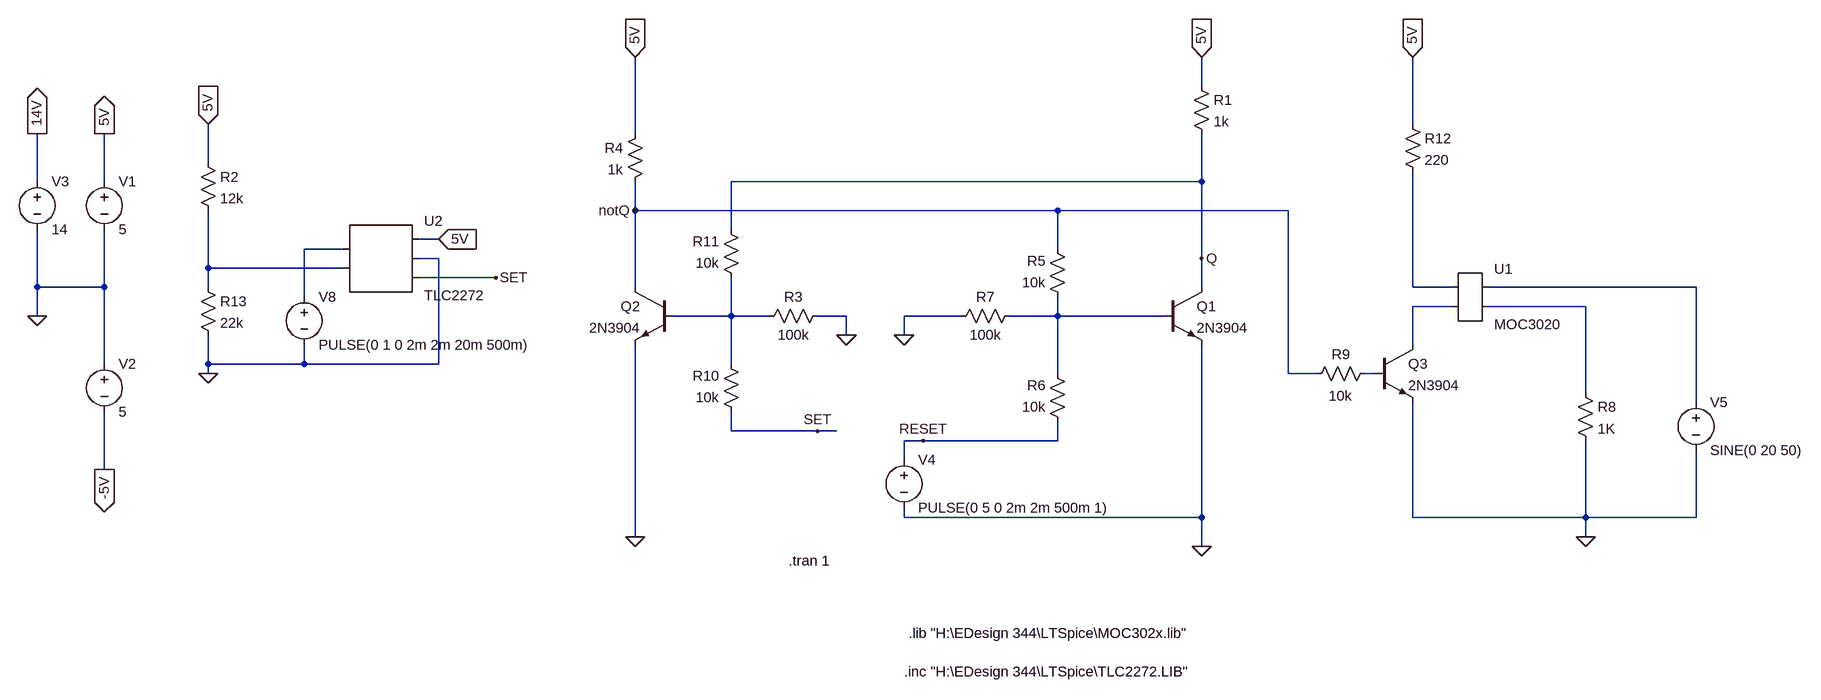
[diagram p0: schematic switch.asc]
switch.asc, the LTspice schematic file:
Version 4
SHEET 1 1960 1220
WIRE -656 -432 -656 -480
WIRE -304 -368 -304 -480
WIRE -1600 -352 -1600 -480
WIRE -2720 -304 -2720 -368
WIRE -3120 -272 -3120 -352
WIRE -3008 -272 -3008 -352
WIRE -656 -272 -656 -352
WIRE -656 -272 -1440 -272
WIRE -1600 -224 -1600 -272
WIRE -896 -224 -1600 -224
WIRE -512 -224 -896 -224
WIRE -1440 -192 -1440 -272
WIRE -2336 -176 -2368 -176
WIRE -2496 -160 -2560 -160
WIRE -896 -160 -896 -224
WIRE -2336 -144 -2368 -144
WIRE -656 -144 -656 -272
WIRE -2720 -128 -2720 -224
WIRE -2496 -128 -2720 -128
WIRE -2240 -112 -2368 -112
WIRE -3120 -96 -3120 -192
WIRE -3008 -96 -3008 -192
WIRE -3008 -96 -3120 -96
WIRE -2720 -96 -2720 -128
WIRE -1600 -96 -1600 -224
WIRE -656 -96 -656 -144
WIRE -304 -96 -304 -288
WIRE -240 -96 -304 -96
WIRE 208 -96 -176 -96
WIRE -2560 -80 -2560 -160
WIRE -240 -64 -304 -64
WIRE -16 -64 -176 -64
WIRE -3120 -48 -3120 -96
WIRE -1440 -48 -1440 -112
WIRE -1440 -48 -1536 -48
WIRE -1376 -48 -1440 -48
WIRE -1248 -48 -1296 -48
WIRE -1056 -48 -1152 -48
WIRE -896 -48 -896 -80
WIRE -896 -48 -976 -48
WIRE -720 -48 -896 -48
WIRE -1248 -16 -1248 -48
WIRE -1152 -16 -1152 -48
WIRE -304 0 -304 -64
WIRE -3008 32 -3008 -96
WIRE -2720 32 -2720 -16
WIRE -2560 32 -2560 0
WIRE -2560 32 -2720 32
WIRE -2336 32 -2336 -144
WIRE -2336 32 -2560 32
WIRE -1440 32 -1440 -48
WIRE -2720 48 -2720 32
WIRE -896 48 -896 -48
WIRE -512 48 -512 -224
WIRE -464 48 -512 48
WIRE -368 48 -384 48
WIRE -16 80 -16 -64
WIRE 208 96 208 -96
WIRE -1440 144 -1440 112
WIRE -1296 144 -1440 144
WIRE -1264 144 -1296 144
WIRE -1120 160 -1152 160
WIRE -896 160 -896 128
WIRE -896 160 -1120 160
WIRE -1152 192 -1152 160
WIRE -3008 208 -3008 112
WIRE -1152 288 -1152 272
WIRE -656 288 -656 0
WIRE -656 288 -1152 288
WIRE -304 288 -304 96
WIRE -16 288 -16 160
WIRE -16 288 -304 288
WIRE 208 288 208 176
WIRE 208 288 -16 288
WIRE -1600 320 -1600 0
WIRE -16 320 -16 288
WIRE -656 336 -656 288
FLAG -656 336 0
FLAG -1600 320 0
FLAG -16 320 0
FLAG -3120 -48 0
FLAG -3008 -352 5V
IOPIN -3008 -352 Out
FLAG -3008 208 -5V
IOPIN -3008 208 Out
FLAG -3120 -352 14V
IOPIN -3120 -352 Out
FLAG -1600 -480 5V
IOPIN -1600 -480 In
FLAG -656 -480 5V
IOPIN -656 -480 In
FLAG -1248 -16 0
FLAG -1152 -16 0
FLAG -304 -480 5V
IOPIN -304 -480 In
FLAG -1120 160 RESET
FLAG -1296 144 SET
FLAG -656 -144 Q
FLAG -1600 -224 notQ
FLAG -2720 -368 5V
IOPIN -2720 -368 In
FLAG -2720 48 0
FLAG -2240 -112 SET
FLAG -2336 -176 5V
IOPIN -2336 -176 In
SYMBOL npn -720 -96 R0
SYMATTR InstName Q1
SYMATTR Value 2N3904
SYMBOL res -672 -448 R0
SYMATTR InstName R1
SYMATTR Value 1k
SYMBOL npn -1536 -96 M0
SYMATTR InstName Q2
SYMATTR Value 2N3904
SYMBOL res -1584 -368 M0
SYMATTR InstName R4
SYMATTR Value 1k
SYMBOL voltage 208 80 R0
WINDOW 123 0 0 Left 2
WINDOW 39 0 0 Left 2
SYMATTR InstName V5
SYMATTR Value SINE(0 20 50)
SYMBOL res -32 64 R0
SYMATTR InstName R8
SYMATTR Value 1K
SYMBOL voltage -3008 -288 R0
WINDOW 123 0 0 Left 2
WINDOW 39 0 0 Left 2
SYMATTR InstName V1
SYMATTR Value 5
SYMBOL voltage -3008 16 R0
WINDOW 123 0 0 Left 2
WINDOW 39 0 0 Left 2
SYMATTR InstName V2
SYMATTR Value 5
SYMBOL voltage -3120 -288 R0
WINDOW 123 0 0 Left 2
WINDOW 39 0 0 Left 2
SYMATTR InstName V3
SYMATTR Value 14
SYMBOL res -880 -64 R180
WINDOW 0 36 76 Left 2
WINDOW 3 36 40 Left 2
SYMATTR InstName R5
SYMATTR Value 10k
SYMBOL res -880 144 R180
WINDOW 0 36 76 Left 2
WINDOW 3 36 40 Left 2
SYMATTR InstName R6
SYMATTR Value 10k
SYMBOL res -1424 128 R180
WINDOW 0 36 76 Left 2
WINDOW 3 36 40 Left 2
SYMATTR InstName R10
SYMATTR Value 10k
SYMBOL res -1424 -96 R180
WINDOW 0 36 76 Left 2
WINDOW 3 36 40 Left 2
SYMATTR InstName R11
SYMATTR Value 10k
SYMBOL voltage -1152 176 R0
WINDOW 123 0 0 Left 2
WINDOW 39 0 0 Left 2
SYMATTR InstName V4
SYMATTR Value PULSE(0 5 0 2m 2m 500m 1)
SYMBOL res -1392 -32 R270
WINDOW 0 32 56 VTop 2
WINDOW 3 0 56 VBottom 2
SYMATTR InstName R3
SYMATTR Value 100k
SYMBOL res -1072 -32 R270
WINDOW 0 32 56 VTop 2
WINDOW 3 0 56 VBottom 2
SYMATTR InstName R7
SYMATTR Value 100k
SYMBOL npn -368 0 R0
SYMATTR InstName Q3
SYMATTR Value 2N3904
SYMBOL res -480 64 R270
WINDOW 0 32 56 VTop 2
WINDOW 3 -6 55 VBottom 2
SYMATTR InstName R9
SYMATTR Value 10k
SYMBOL res -320 -384 R0
SYMATTR InstName R12
SYMATTR Value 220
SYMBOL AutoGenerated\\MOC3020 -208 -80 R0
SYMATTR InstName U1
SYMBOL res -2736 -320 R0
SYMATTR InstName R2
SYMATTR Value 12k
SYMBOL res -2736 -112 R0
SYMATTR InstName R13
SYMATTR Value 22k
SYMBOL AutoGenerated\\TLC2272 -2432 -144 R0
SYMATTR InstName U2
SYMBOL voltage -2560 -96 R0
WINDOW 123 0 0 Left 2
WINDOW 39 0 0 Left 2
SYMATTR InstName V8
SYMATTR Value PULSE(0 1 0 2m 2m 20m 500m)
TEXT -1344 360 Left 2 !.tran 1
TEXT -1144 608 Left 2 !.lib "H:\\EDesign 344\\LTSpice\\MOC302x.lib"
TEXT -1152 672 Left 2 !.inc "H:\\EDesign 344\\LTSpice\\TLC2272.LIB"

The netlist it stands for:
* switch.asc
Q1 Q N008 0 0 2N3904
R1 5V Q 1k
Q2 notQ N007 0 0 2N3904
R4 5V notQ 1k
V5 N004 0 SINE(0 20 50)
R8 N006 0 1K
V1 5V 0 5
V2 0 -5V 5
V3 14V 0 14
R5 N008 notQ 10k
R6 RESET N008 10k
R10 SET N007 10k
R11 N007 Q 10k
V4 RESET 0 PULSE(0 5 0 2m 2m 500m 1)
R3 N007 0 100k
R7 0 N008 100k
Q3 N005 N009 0 0 2N3904
R9 notQ N009 10k
R12 5V N003 220
* U1: MOC3020 (symbol AutoGenerated\MOC3020 not available, pins judged from their places): pin1=N003 pin2=N005 pin3=N004 pin4=N006
R2 5V N002 12k
R13 N002 0 22k
* U2: TLC2272 (symbol AutoGenerated\TLC2272 not available, pins judged from their places): pin1=N001 pin2=N002 pin3=5V pin4=0 pin5=SET
V8 N001 0 PULSE(0 1 0 2m 2m 20m 500m)
.model NPN NPN
.model PNP PNP
.lib standard.bjt
.tran 1
.lib "H:\EDesign 344\LTSpice\MOC302x.lib"
.inc "H:\EDesign 344\LTSpice\TLC2272.LIB"
.backanno
.end